# EAGLE schematic Pedal Box Board rev4 (EAGLE 8.2.1)
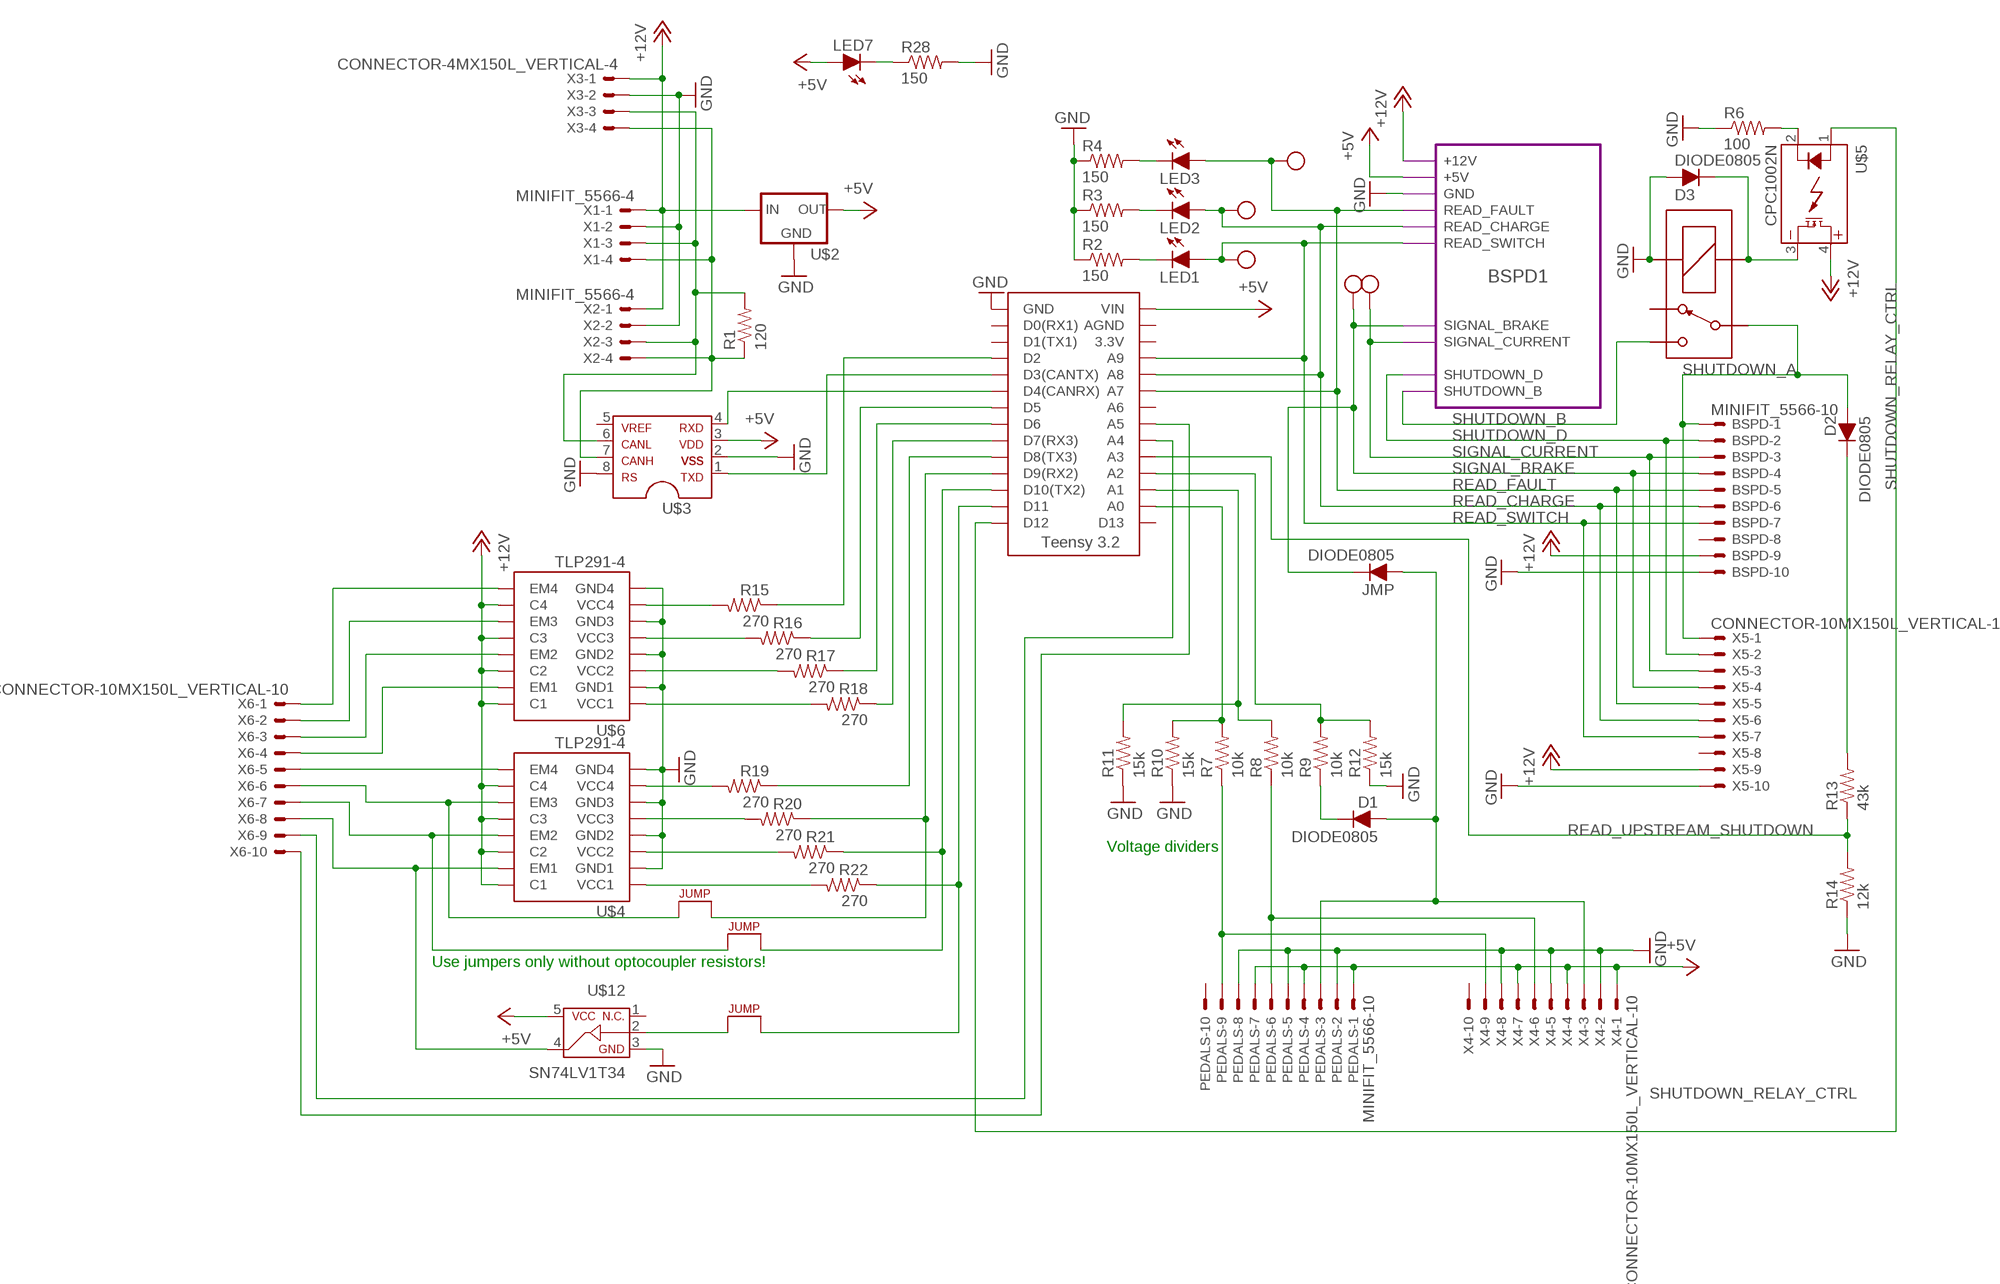
[diagram p0: schematic, sheet 1, part 1 of 2]
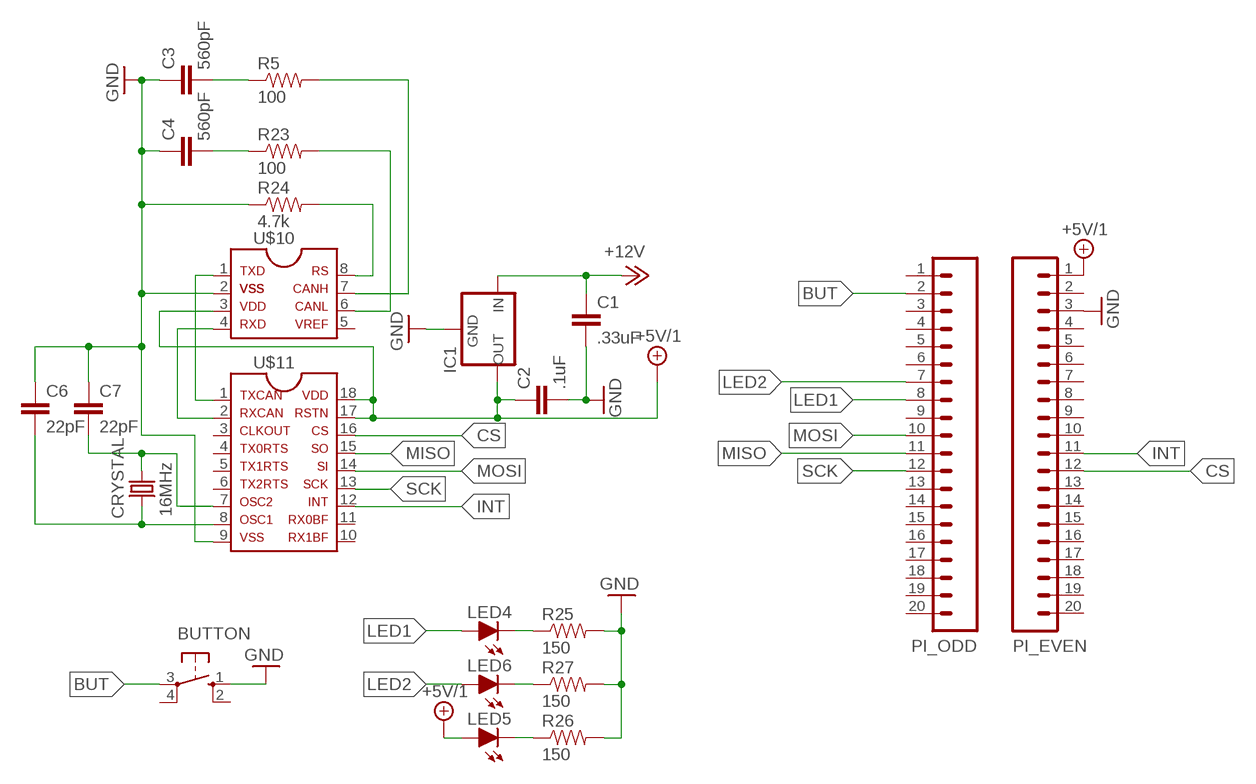
[diagram p1: schematic, sheet 1, part 2 of 2]

## Parts
BSPD  MINIFIT_5566-10  [MINIFIT_5566-10]
BUTTON  BTN_10-XX  [B3F-10XX]
C1  .33uF  CAP0805  [0805]
C2  .1uF  CAP0805  [0805]
C3  560pF  CAP0805  [0805]
C4  560pF  CAP0805  [0805]
C6  22pF  CAP0805  [0805]
C7  22pF  CAP0805  [0805]
CRYSTAL  16MHz  CRYSTALSMD  [HC49UP]
D1  DIODE0805  [0805_D]
D2  DIODE0805  [0805_D]
D3  DIODE0805  [0805_D]
IC1  5VREG_L7805_HOR  [TO-220-H]
JMP  DIODE0805  [0805_D]
LED1  LED-0805  [LED-805]
LED2  LED-0805  [LED-805]
LED3  LED-0805  [LED-805]
LED4  LED-0805  [LED-805]
LED5  LED-0805  [LED-805]
LED6  LED-0805  [LED-805]
LED7  LED-0805  [LED-805]
PEDALS  MINIFIT_5566-10  [MINIFIT_5566-10]
PI_EVEN  M20  [1X20]
PI_ODD  M20  [1X20]
R1  120  RESISTOR0805-RES  [0805]
R2  150  RESISTOR0805-RES  [0805]
R3  150  RESISTOR0805-RES  [0805]
R4  150  RESISTOR0805-RES  [0805]
R5  100  RESISTOR0805-RES  [0805]
R6  100  RESISTOR0805-RES  [0805]
R7  10k  RESISTOR0805-RES  [0805]
R8  10k  RESISTOR0805-RES  [0805]
R9  10k  RESISTOR0805-RES  [0805]
R10  15k  RESISTOR0805-RES  [0805]
R11  15k  RESISTOR0805-RES  [0805]
R12  15k  RESISTOR0805-RES  [0805]
R13  43k  RESISTOR0805-RES  [0805]
R14  12k  RESISTOR0805-RES  [0805]
R15  270  RESISTOR0805-RES  [0805]
R16  270  RESISTOR0805-RES  [0805]
R17  270  RESISTOR0805-RES  [0805]
R18  270  RESISTOR0805-RES  [0805]
R19  270  RESISTOR0805-RES  [0805]
R20  270  RESISTOR0805-RES  [0805]
R21  270  RESISTOR0805-RES  [0805]
R22  270  RESISTOR0805-RES  [0805]
R23  100  RESISTOR0805-RES  [0805]
R24  4.7k  RESISTOR0805-RES  [0805]
R25  150  RESISTOR0805-RES  [0805]
R26  150  RESISTOR0805-RES  [0805]
R27  150  RESISTOR0805-RES  [0805]
R28  150  RESISTOR0805-RES  [0805]
SOFTWARE_SHUTOFF  G5LE  [ZF112]
U$1  TEENSY_3.2_SIMPLE  [TEENSY_3.2_SIMPLE]
U$2  5VREG_LM340-NLM340MPX-5.0/NOPB  [SOT223]
U$3  MCP2551  [SOIC-08]
U$4  TLP291-4  [SOIC-16]
U$5  CPC1002N  [SOP04]
U$6  TLP291-4  [SOIC-16]
U$7  JUMPER  [0805]
U$8  JUMPER  [0805]
U$9  JUMPER  [0805]
U$10  MCP2551  [SOIC-08]
U$11  MCP2515SMD  [SOIC-18W]
U$12  SN74LV1T34  [SOT-23-5]
U$13  TEST_POINT  [TEST_POINT]
U$14  TEST_POINT  [TEST_POINT]
U$15  TEST_POINT  [TEST_POINT]
U$16  TEST_POINT  [TEST_POINT]
U$17  TEST_POINT  [TEST_POINT]
X1  MINIFIT_5566-4  [MINIFIT_5566-4]
X2  MINIFIT_5566-4  [MINIFIT_5566-4]
X3  CONNECTOR-4MX150L_VERTICAL-4  [MX150L_VERTICAL-4]
X4  CONNECTOR-10MX150L_VERTICAL-10  [MX150L_VERTICAL-10]
X5  CONNECTOR-10MX150L_VERTICAL-10  [MX150L_VERTICAL-10]
X6  CONNECTOR-10MX150L_VERTICAL-10  [MX150L_VERTICAL-10]

## Module instances
BSPD1 = BSPD

## Nets
+5V: LED7.A PEDALS.1 PEDALS.4 PEDALS.7 U$1.VIN U$2.3(OUT) U$3.3 U$12.5 X4.1 X4.4 X4.7 ; port BSPD1.+5V
+5V/1: C2.1 IC1.3(OUT) LED5.A PI_EVEN.1 U$10.3 U$11.17 U$11.18
+12V: BSPD.9 C1.1 IC1.1(IN) U$2.1(IN) U$4.10(C4) U$4.12(C3) U$4.14(C2) U$4.16(C1) U$5.4(DC+) U$6.10(C4) U$6.12(C3) U$6.14(C2) U$6.16(C1) X1.1 X2.1 X3.1 X5.9 ; port BSPD1.+12V
BUT: BUTTON.3(P) PI_ODD.2
CAN-H: R5.2 U$10.7
CAN-L: R23.2 U$10.6
CS: PI_EVEN.12 U$11.16
GND: BSPD.10 BUTTON.1(S) C1.2 C2.2 C3.1 C4.1 C6.1 C7.1 D3.A IC1.2(GND) PEDALS.2 PEDALS.5 PEDALS.8 PI_EVEN.3 R2.1 R3.1 R4.1 R6.1 R10.1 R11.1 R12.1 R14.1 R24.1 R25.2 R26.2 R27.2 R28.2 SOFTWARE_SHUTOFF.1(COIL+) U$1.GND U$2.2(GND) U$2.4(GND) U$3.2 U$3.8 U$4.2(GND1) U$4.4(GND2) U$4.6(GND3) U$4.8(GND4) U$6.2(GND1) U$6.4(GND2) U$6.6(GND3) U$6.8(GND4) U$10.2 U$11.9 U$12.3 X1.2 X2.2 X3.2 X4.2 X4.5 X4.8 X5.10 ; port BSPD1.GND
INT: PI_EVEN.11 U$11.12
LED1: LED4.A PI_ODD.8
LED2: LED6.A PI_ODD.7
MISO: PI_ODD.11 U$11.15
MOSI: PI_ODD.10 U$11.14
N$1: PEDALS.9 R7.1 X4.9
N$2: U$1.D4(CANRX) U$3.4
N$3: R1.2 U$3.6 X1.3 X2.3 X3.3
N$4: R1.1 U$3.7 X1.4 X2.4 X3.4
N$5: U$1.D3(CANTX) U$3.1
N$6: R8.2 R11.2 U$1.A1
N$7: D1.C R9.1
N$8: PEDALS.6 R8.1 X4.6
N$9: R7.2 R10.2 U$1.A0
N$10: R9.2 R12.2 U$1.A2
N$11: D1.A JMP.A PEDALS.3 X4.3
N$12: D3.C SOFTWARE_SHUTOFF.2(COIL-) U$5.3(DC-)
N$13: D2.C R13.2
N$14: LED1.C R2.2
N$15: LED2.C R3.2
N$16: LED3.C R4.2
N$17: R21.1 U$1.D10(TX2) U$8.2
N$18: R17.1 U$1.D6
N$19: R15.2 U$6.7(VCC4)
N$20: R15.1 U$1.D2
N$21: R16.1 U$1.D5
N$22: R6.2 U$5.2(CONTROL-)
N$23: R18.1 U$1.D7(RX3)
N$24: R16.2 U$6.5(VCC3)
N$25: R20.1 U$1.D9(RX2) U$7.2
N$26: R22.1 U$1.D11 U$9.2
N$27: R21.2 U$4.3(VCC2)
N$28: R17.2 U$6.3(VCC2)
N$29: R18.2 U$6.1(VCC1)
N$30: R19.1 U$1.D8(TX3)
N$31: R19.2 U$4.7(VCC4)
N$32: R20.2 U$4.5(VCC3)
N$33: U$1.A5 X6.10
N$34: U$1.A4 X6.9
N$35: R22.2 U$4.1(VCC1)
N$36: U$4.13(EM2) U$8.1 X6.7
N$37: U$10.1 U$11.1
N$38: U$4.15(EM1) U$12.4 X6.8
N$39: U$10.4 U$11.2
N$40: C6.2 CRYSTAL.2 U$11.8
N$41: R24.2 U$10.8
N$42: C7.2 CRYSTAL.1 U$11.7
N$43: C3.2 R5.1
N$44: U$6.9(EM4) X6.1
N$45: U$6.11(EM3) X6.2
N$46: U$6.13(EM2) X6.3
N$47: U$6.15(EM1) X6.4
N$48: U$4.9(EM4) X6.5
N$49: U$4.11(EM3) U$7.1 X6.6
N$50: C4.2 R23.1
N$51: U$9.1 U$12.2
N$52: LED4.C R25.1
N$53: LED5.C R26.1
N$54: LED6.C R27.1
N$61: LED7.C R28.1
READ_CHARGE: BSPD.6 LED2.A U$1.A8 U$16.P$1 X5.6 ; port BSPD1.READ_CHARGE
READ_FAULT: BSPD.5 LED3.A U$1.A7 U$15.P$1 X5.5 ; port BSPD1.READ_FAULT
READ_SWITCH: BSPD.7 LED1.A U$1.A9 U$17.P$1 X5.7 ; port BSPD1.READ_SWITCH
READ_UPSTREAM_SHUTDOWN: R13.1 R14.2 U$1.A3
SCK: PI_ODD.12 U$11.13
SHUTDOWN_A: BSPD.1 D2.A SOFTWARE_SHUTOFF.P X5.1
SHUTDOWN_B: SOFTWARE_SHUTOFF.S ; port BSPD1.SHUTDOWN_B
SHUTDOWN_D: BSPD.2 X5.2 ; port BSPD1.SHUTDOWN_D
SHUTDOWN_RELAY_CTRL: U$1.D12 U$5.1(CONTROL+)
SIGNAL_BRAKE: BSPD.4 JMP.C U$13.P$1 X5.4 ; port BSPD1.SIGNAL_BRAKE
SIGNAL_CURRENT: BSPD.3 U$14.P$1 X5.3 ; port BSPD1.SIGNAL_CURRENT
Unconnected: BSPD.8 BUTTON.2(S1) BUTTON.4(P1) PEDALS.10 PI_EVEN.2 PI_EVEN.4 PI_EVEN.5 PI_EVEN.6 PI_EVEN.7 PI_EVEN.8 PI_EVEN.9 PI_EVEN.10 PI_EVEN.13 PI_EVEN.14 PI_EVEN.15 PI_EVEN.16 PI_EVEN.17 PI_EVEN.18 PI_EVEN.19 PI_EVEN.20 PI_ODD.1 PI_ODD.3 PI_ODD.4 PI_ODD.5 PI_ODD.6 PI_ODD.9 PI_ODD.13 PI_ODD.14 PI_ODD.15 PI_ODD.16 PI_ODD.17 PI_ODD.18 PI_ODD.19 PI_ODD.20 SOFTWARE_SHUTOFF.O U$1.3.3V U$1.A6 U$1.AGND U$1.D0(RX1) U$1.D1(TX1) U$1.D13 U$3.5 U$10.5 U$11.3 U$11.4 U$11.5 U$11.6 U$11.10 U$11.11 U$12.1 X4.10 X5.8

## Notes on the sheet
- Voltage dividers
- Use jumpers only without optocoupler resistors!

## Library data of the parts
BSPD PEDALS = HyTechDevices:MINIFIT_5566-10: Mini-Fit Junior connector 10 pole Source: http://www.molex.com; OC_FARNELL: unknown; OC_NEWARK: unknown
BUTTON = HyTechDevices:BTN_10-XX: Small momentary tactile push button; MPN: B3F-1000; OC_FARNELL: 176432; OC_NEWARK: 36M3542
C1-C4 C6 C7 = HyTechDevices:CAP: Capacitor Standard 0603 ceramic capacitor, and 0.1" leaded capacitor.
CRYSTAL = SparkFun-FreqCtrl:CRYSTAL: Various standard crystals. Proven footprints.
D1-D3 JMP = HyTechDevices:DIODE: DIODE general purpose rectifier
IC1 = HyTechDevices:5VREG_L7805: Voltage Regulator Switching 5v regulator Datasheet <http://power.murata.com/data/power/oki-78sr.pdf> Standard 7805 5V regulator. IGO (Input Ground Output). Spark Fun Electronics SKU : COM-00107 Datasheet <http://www.mouser.com/ds/2/308/MC7800-D-94905.pdf>
LED1-LED7 = HyTechDevices:LED: Light Emitting Diode (LED) Source: Dangerous Prototypes Eagle Library <https://github.com/DangerousPrototypes/Eagle_Part_Library>
PI_EVEN PI_ODD = HyTechDevices:M20: 1x20 .1" header This is just like the LOCK variant in that the holes are staggared by 5 mil, but except for the last two holes. They are not altered from the "standard" footprint layout. This is used for a special purpose on the layout of our Graphic LCD Backpack. Make sure you want to use this device before selecting it for you project! Source: Sparkfun <https://github.com/sparkfun/SparkFun-Eagle-Libraries>
R1-R28 = HyTechDevices:RESISTOR: Resistor Basic schematic elements and footprints for 0603, 1206, and PTH resistors.
SOFTWARE_SHUTOFF = HyTechDevices:G5LE: Omron G5LE SPST Relay 5 VDC, 12VDC, 24VDC models Coil voltage: 75% - 170% of nominal voltage Datasheet <https://www.omron.com/ecb/products/pdf/en-g5le.pdf>
U$1 = HyTechDevices:TEENSY_3.2_SIMPLE: Simple version of the Teensy 3.2 board that only uses the 2 main rows of pins, not the inner pins or the pins opposite the usb port.
U$2 = HyTechDevices:5VREG_LM340-N: Voltage Regulator 5v linear voltage regulator Datasheet <http://www.mouser.com/ProductDetail/Texas-Instruments/LM340MPX-50-NOPB/?qs=X1J7HmVL2ZGZwtTFRQ9ItA%3D%3D> MAX current out: 1.5A MAX voltage in: 35V
U$3 U$10 = HyTechDevices:MCP2551: MCP2551 High-Speed CAN Transceiver Product Webpage <https://www.microchip.com/wwwproducts/en/MCP2551> Datasheet <http://ww1.microchip.com/downloads/en/DeviceDoc/21667f.pdf> This device is outdated It is replaced by MCP2561. Comparison Page <https://www.microchip.com/wwwproducts/ProductCompare/MCP2551/MCP2561> Product Webpage <https://www.microchip.com/wwwproducts/en/MCP2561> Datasheet <http://ww1.microchip.com/downloads/en/DeviceDoc/20005167C.pdf>
U$4 U$6 = HyTechDevices:TLP291-4: Toshiba Quad Channel Optocoupler TLP291-4
U$5 = HyTechDevices:CPC1002N: IXYS Solid State Relay .7A
U$7-U$9 = HyTechDevices:JUMPER: Jumper for changing operation of a device
U$11 = HyTechDevices:MCP2515: MCP2515 CAN Controller with SPI Interface Datasheet <http://ww1.microchip.com/downloads/en/DeviceDoc/21801G.pdf>
U$12 = HyTechDevices:SN74LV1T34: TI SN74LV1T34 Single Power Supply Single Buffer GATE CMOS Logic Level Shifter Datasheet <http://www.ti.com/lit/ds/symlink/sn74lv1t34.pdf>
U$13-U$17 = HyTechDevices:TEST_POINT: Keystone Electronics Test Point 5005
X1 X2 = HyTechDevices:MINIFIT_5566-4: Mini-Fit Junior connector 4 pole Source: http://www.molex.com; OC_FARNELL: unknown; OC_NEWARK: unknown
X3 = HyTechDevices:CONNECTOR-4: Mini-Fit Junior connector 4 pole Source: http://www.molex.com
X4-X6 = HyTechDevices:CONNECTOR-10: Mini-Fit Junior connector 10 pole Source: http://www.molex.com

## Module BSPD
Ports: GND(out) +5V(in) READ_CHARGE(out) SHUTDOWN_B(in) READ_SWITCH(out) READ_FAULT(out) SHUTDOWN_D(out) SIGNAL_BRAKE(in) SIGNAL_CURRENT(in) +12V(in)
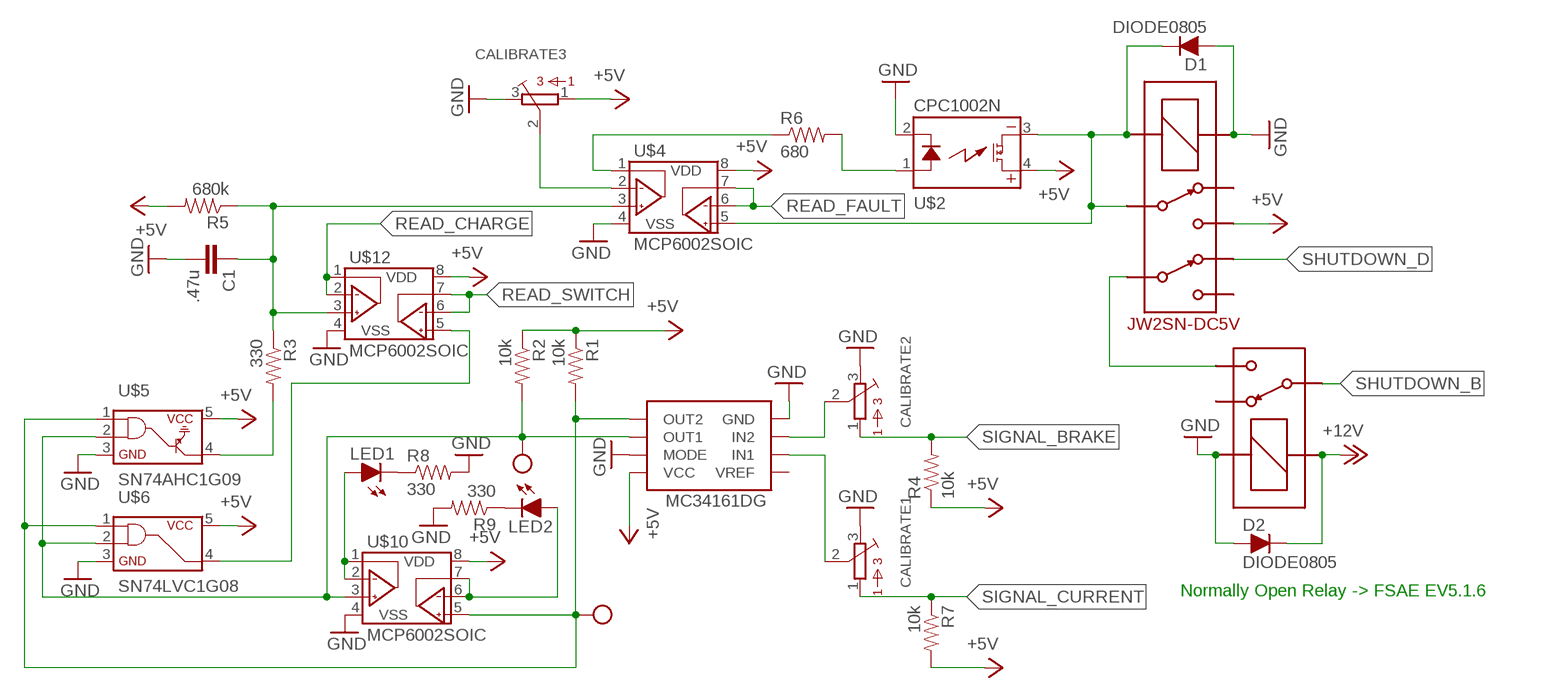
[diagram p2: schematic, module BSPD, sheet 1]

### Parts
C1  .47u  CAPEZ  [CAP-PTH-SMALLEZ]
CALIBRATE1  TRIMPOT_3296C  [TRIMPOT_3296]
CALIBRATE2  TRIMPOT_3296C  [TRIMPOT_3296]
CALIBRATE3  TRIMPOT_3296C  [TRIMPOT_3296]
D1  DIODE0805  [0805_D]
D2  DIODE0805  [0805_D]
LED1  LED-0805  [LED-805]
LED2  LED-0805  [LED-805]
MC34161DG  MC34161DG  [SOIC-08]
R1  10k  RESISTOR0805-RES  [0805]
R2  10k  RESISTOR0805-RES  [0805]
R3  330  RESISTOR0805-RES  [0805]
R4  10k  RESISTOR0805-RES  [0805]
R5  680k  RESISTOREZ  [AXIAL-0.3EZ]
R6  680  RESISTOR0805-RES  [0805]
R7  10k  RESISTOR0805-RES  [0805]
R8  330  RESISTOR0805-RES  [0805]
R9  330  RESISTOR0805-RES  [0805]
U$1  G5LE  [ZF112]
U$2  CPC1002N  [SOP04]
U$3  JW2SN-DC5V  [JW2SN]
U$4  MCP6002SOIC  [SOIC-08]
U$5  SN74AHC1G09  [SOT-23-5]
U$6  SN74LVC1G08  [SOT-23-5]
U$10  MCP6002SOIC  [SOIC-08]
U$11  TEST_POINT  [TEST_POINT]
U$12  MCP6002SOIC  [SOIC-08]
U$13  TEST_POINT  [TEST_POINT]

### Nets
+5V: CALIBRATE3.1 MC34161DG.8(VCC) R1.1 R2.1 R4.1 R5.P$2 R7.2 U$2.4(DC+) U$3.4 U$4.8(VDD) U$5.5 U$6.5 U$10.8(VDD) U$12.8(VDD)
+12V: D2.C U$1.2(COIL-)
GND: C1.2 CALIBRATE1.3 CALIBRATE2.3 CALIBRATE3.3 D1.A D2.A MC34161DG.4(GND) MC34161DG.7(MODE) R8.2 R9.2 U$1.1(COIL+) U$2.2(CONTROL-) U$3.COIL+ U$4.4(VSS) U$5.3 U$6.3 U$10.4(VSS) U$12.4(VSS)
N$1: D1.C U$2.3(DC-) U$3.3 U$3.COIL- U$4.5(VINB+)
N$2: R3.2 U$5.4
N$3: R6.2 U$2.1(CONTROL+)
N$4: MC34161DG.5(OUT2) R1.2 U$5.1 U$6.1 U$10.5(VINB+) U$11.P$1
N$5: CALIBRATE2.2 MC34161DG.3(IN2)
N$6: CALIBRATE1.2 MC34161DG.2(IN1)
N$7: CALIBRATE3.2 U$4.2(VINA-)
N$8: LED2.A U$10.6(VINB-) U$10.7(VOUTB)
N$9: R6.1 U$4.1(VOUTA)
N$10: U$6.4 U$12.5(VINB+)
N$11: MC34161DG.6(OUT1) R2.2 U$5.2 U$6.2 U$10.3(VINA+) U$13.P$1
N$12: LED1.A U$10.1(VOUTA) U$10.2(VINA-)
N$13: C1.1 R3.1 R5.P$1 U$4.3(VINA+) U$12.3(VINA+)
N$14: LED1.C R8.1
N$15: LED2.C R9.1
READ_CHARGE: U$12.1(VOUTA) U$12.2(VINA-)
READ_FAULT: U$4.6(VINB-) U$4.7(VOUTB)
READ_SWITCH: U$12.6(VINB-) U$12.7(VOUTB)
SHUTDOWN_B: U$1.P
SHUTDOWN_C: U$1.S U$3.6
SHUTDOWN_D: U$3.7
SIGNAL_BRAKE: CALIBRATE2.1 R4.2
SIGNAL_CURRENT: CALIBRATE1.1 R7.1
Unconnected: MC34161DG.1(VREF) U$1.O U$3.2 U$3.5

### Notes on the sheet
- Normally Open Relay -> FSAE EV5.1.6

### Library data of the parts
C1 = HyTechDevices:CAP: Capacitor Standard 0603 ceramic capacitor, and 0.1" leaded capacitor.
CALIBRATE1-CALIBRATE3 = HyTechDevices:TRIMPOT_3296: 3296 Series 3/8" Square Trimmer Source <https://github.com/chiengineer/Eagle-Libraries/blob/master/Potentiometers/bourns.lbr>
D1 D2 = HyTechDevices:DIODE: DIODE general purpose rectifier
LED1 LED2 = HyTechDevices:LED: Light Emitting Diode (LED) Source: Dangerous Prototypes Eagle Library <https://github.com/DangerousPrototypes/Eagle_Part_Library>
MC34161DG = HyTechDevices:MC34161DG: ON Semiconductor MC34161 Dual Channel Voltage Monitor
R1-R9 = HyTechDevices:RESISTOR: Resistor Basic schematic elements and footprints for 0603, 1206, and PTH resistors.
U$1 = HyTechDevices:G5LE: Omron G5LE SPST Relay 5 VDC, 12VDC, 24VDC models Coil voltage: 75% - 170% of nominal voltage Datasheet <https://www.omron.com/ecb/products/pdf/en-g5le.pdf>
U$2 = HyTechDevices:CPC1002N: IXYS Solid State Relay .7A
U$3 = HyTechDevices:JW2SN-DC5V: Panasonic Double Pull Double Throw Relay 5VDC Datasheet <http://www.mouser.com/ds/2/316/jw-catalog-461998.pdf> Product Page <http://www.mouser.com/ProductDetail/Panasonic-Industrial-Devices/JW2SN-DC5V>
U$4 U$10 U$12 = HyTechDevices:MCP6002: Microchip MCP6002 Dual Channel Op Amp
U$5 = HyTechDevices:SN74AHC1G09: TI SN74AHC1G09 Single 2–Input Positive-AND Gate With Open-Drain Output Datasheet <http://www.ti.com/lit/ds/symlink/sn74ahc1g09.pdf>
U$6 = HyTechDevices:SN74LVC1G08: TI SN74LVC1G08 SINGLE 2-INPUT POSITIVE-AND GATE Datasheet <http://www.ti.com/lit/ds/sces556f/sces556f.pdf>
U$11 U$13 = HyTechDevices:TEST_POINT: Keystone Electronics Test Point 5005